# EAGLE design PSoC_DCO_Mini_Shield (EAGLE 7.2.0)
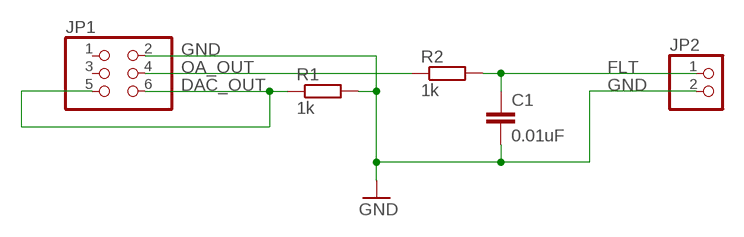
[diagram p0: schematic, sheet 1]

## Parts
C1  0.01uF  C-EU025-025X050  [C025-025X050]
JP1  PINHD-2X3  [2X03]
JP2  PINHD-1X2  [1X02]
R1  1k  R-EU_0207/7  [0207/7]
R2  1k  R-EU_0207/7  [0207/7]

## Nets
DAC_OUT: JP1.5 JP1.6 R1.1
FLT: C1.1 JP2.1 R2.2
GND: C1.2 JP1.2 JP2.2 R1.2
OA_OUT: JP1.4 R2.1
Unconnected: JP1.1 JP1.3

## Library data of the parts
C1 = rcl:C-EU: CAPACITOR, European symbol
JP1 = pinhead:PINHD-2X3: PIN HEADER
JP2 = pinhead:PINHD-1X2: PIN HEADER
R1 R2 = rcl:R-EU_: RESISTOR, European symbol

## Board
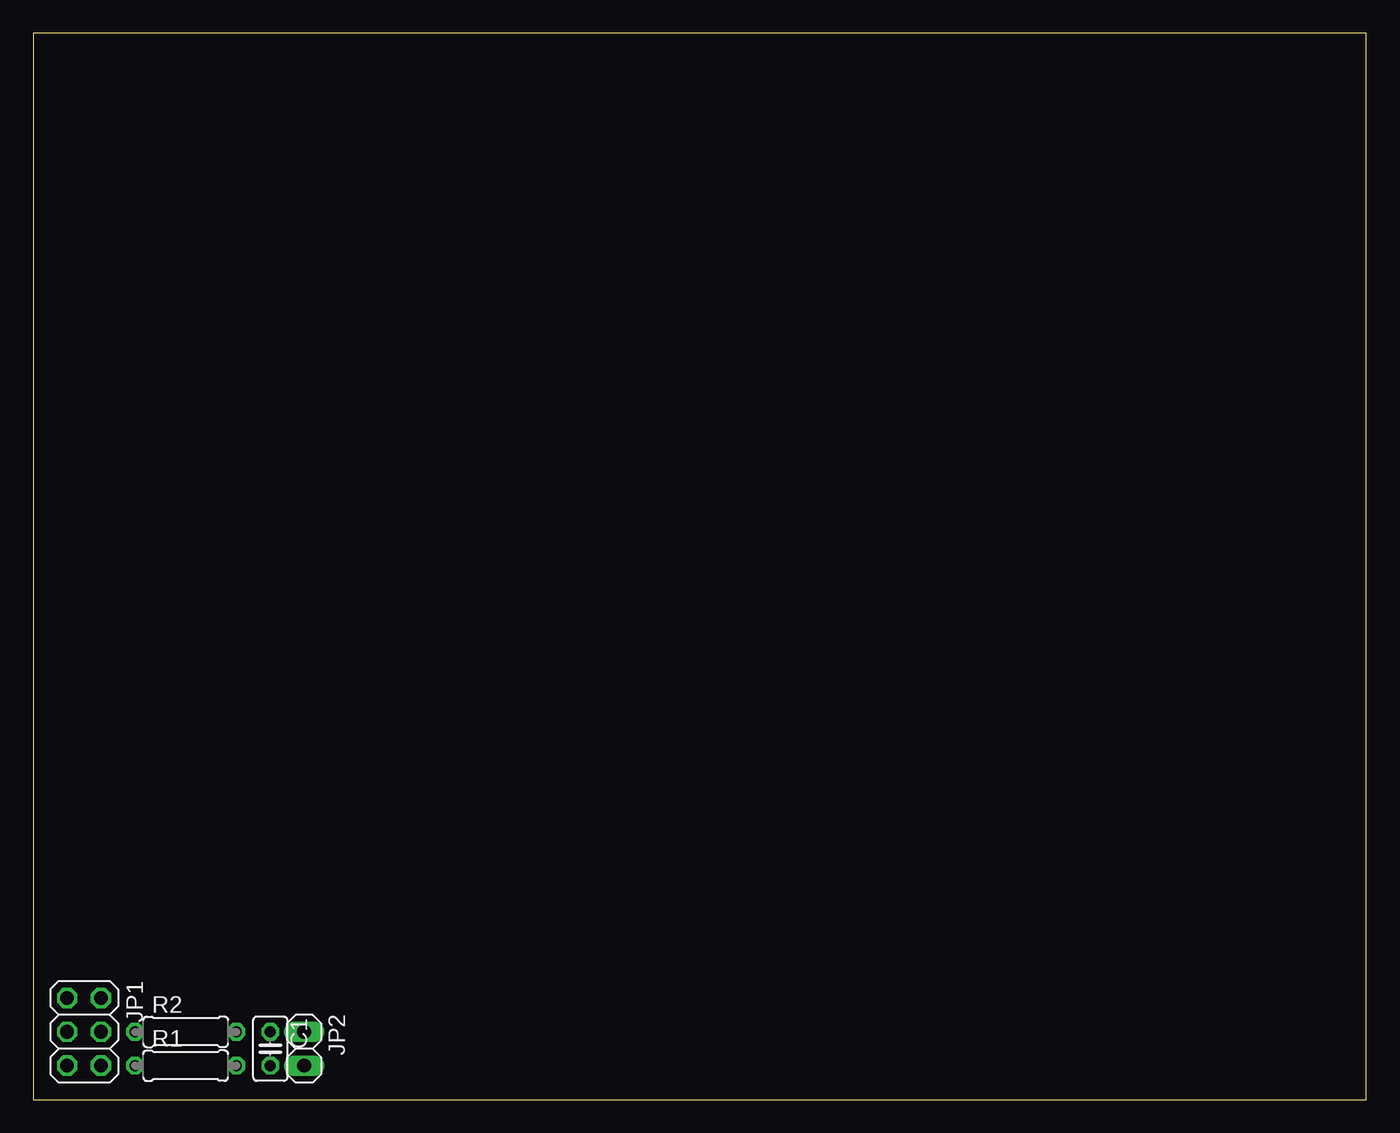
[diagram p1: board, top side]
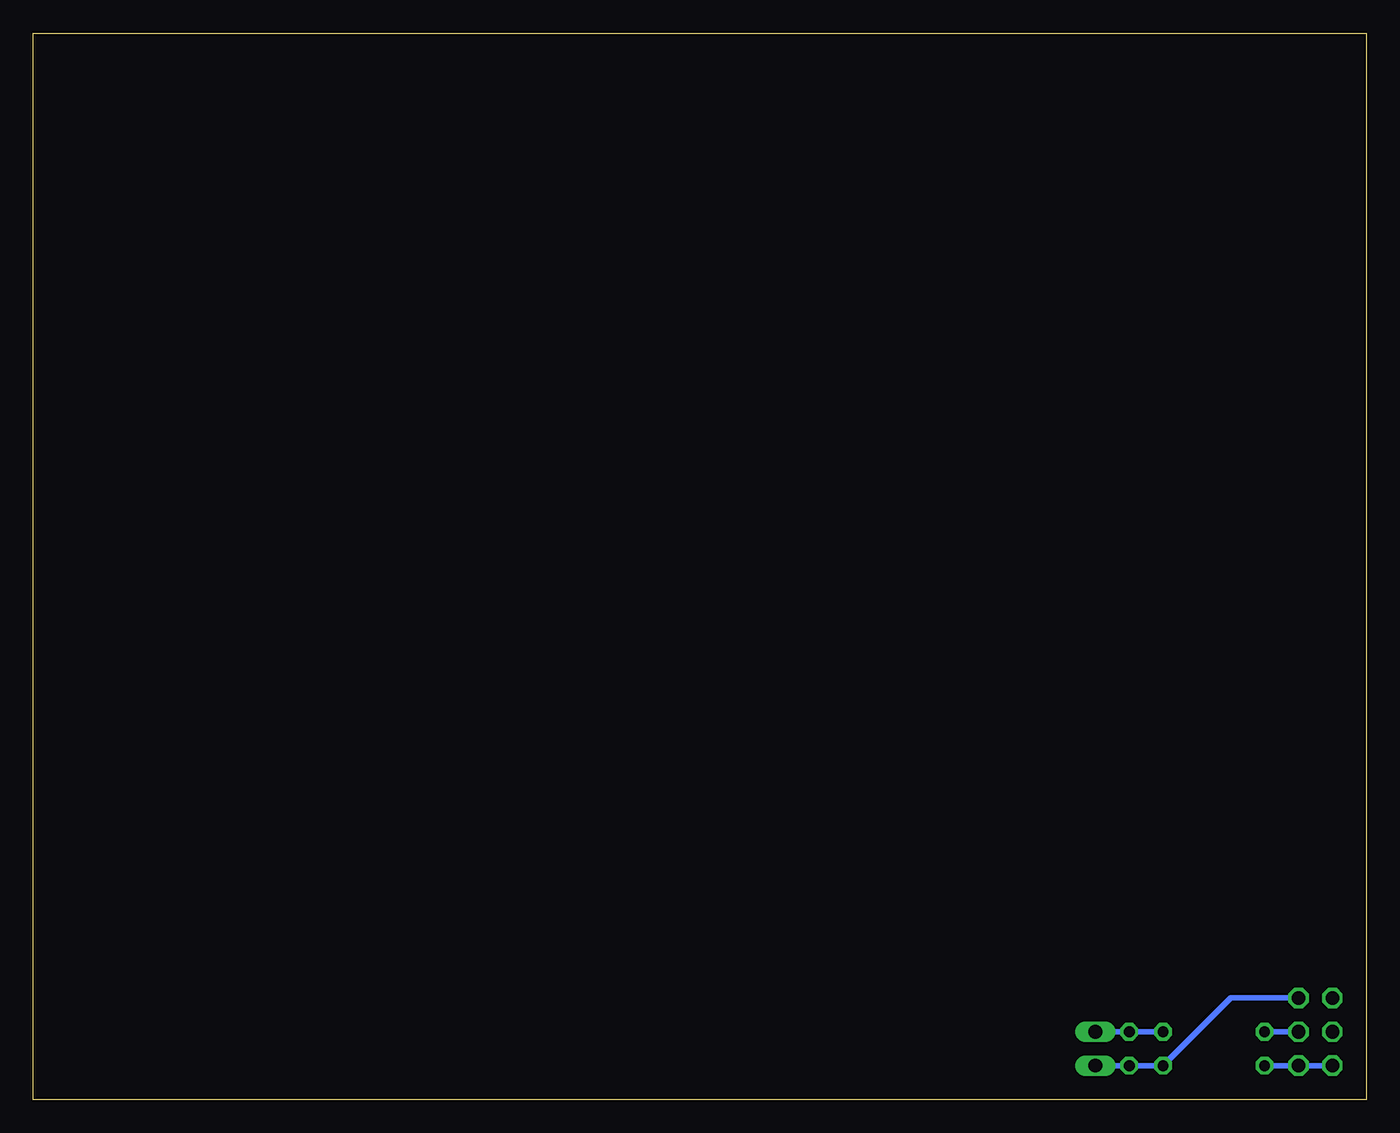
[diagram p2: board, bottom side, seen from below]

Size 100 x 80 mm. Coordinates in mm from the lower left corner, seen from the top.
Outline: 0,0 100,0 100,80 0,80 0,0
Copper layers (1*16): Top 0.035mm / dielectric 1.5mm / Bottom 0.035mm
Design rules "default": minimum track width 10mil, minimum drill 24mil, track to track 8mil, track to pad 8mil, pad to pad 8mil, via to via 8mil, smd to smd 8mil, copper to edge 40mil, drill to drill 8mil, minimum pad ring 10mil, minimum via ring 8mil, stop-mask expansion 4mil, vias tented up to drill 0mil, thermal gap 10mil

### Footprints (pad centres in the part's own frame; a part is rotated, then mirrored left to right if it is on the bottom)
C025-025X050 = drill 0.813 octagon: 1 -1.27,0; 2 1.27,0
2X03 = drill 1.016 octagon: 1 -2.54,-1.27; 2 -2.54,1.27; 3 0,-1.27; 4 0,1.27; 5 2.54,-1.27; 6 2.54,1.27
1X02 = drill 1.016 long: 1 -1.27,0; 2 1.27,0
0207/7 = drill 0.813 octagon: 1 -3.81,0; 2 3.81,0

### Placement (x,y rotation side)
C1  17.78,3.81 270 top
JP1  3.81,5.08 270 top
JP2  20.32,3.81 270 top
R1  11.43,2.54 0 top
R2  11.43,5.08 0 top

### Tracks (layer width: path | path; a pad name or v marks a point on that pad's centre or on a via)
DAC_OUT
  Bottom 0.406: JP1.5 JP1.6 R1.1
FLT
  Bottom 0.406: R2.2 C1.1 JP2.1
GND
  Bottom 0.406: JP2.2 C1.2 R1.2 10.16,7.62 JP1.2
OA_OUT
  Bottom 0.406: JP1.4 R2.1